# EAGLE schematic Piezo_signal_amp_filter_v0.1 (EAGLE 9.5.2)
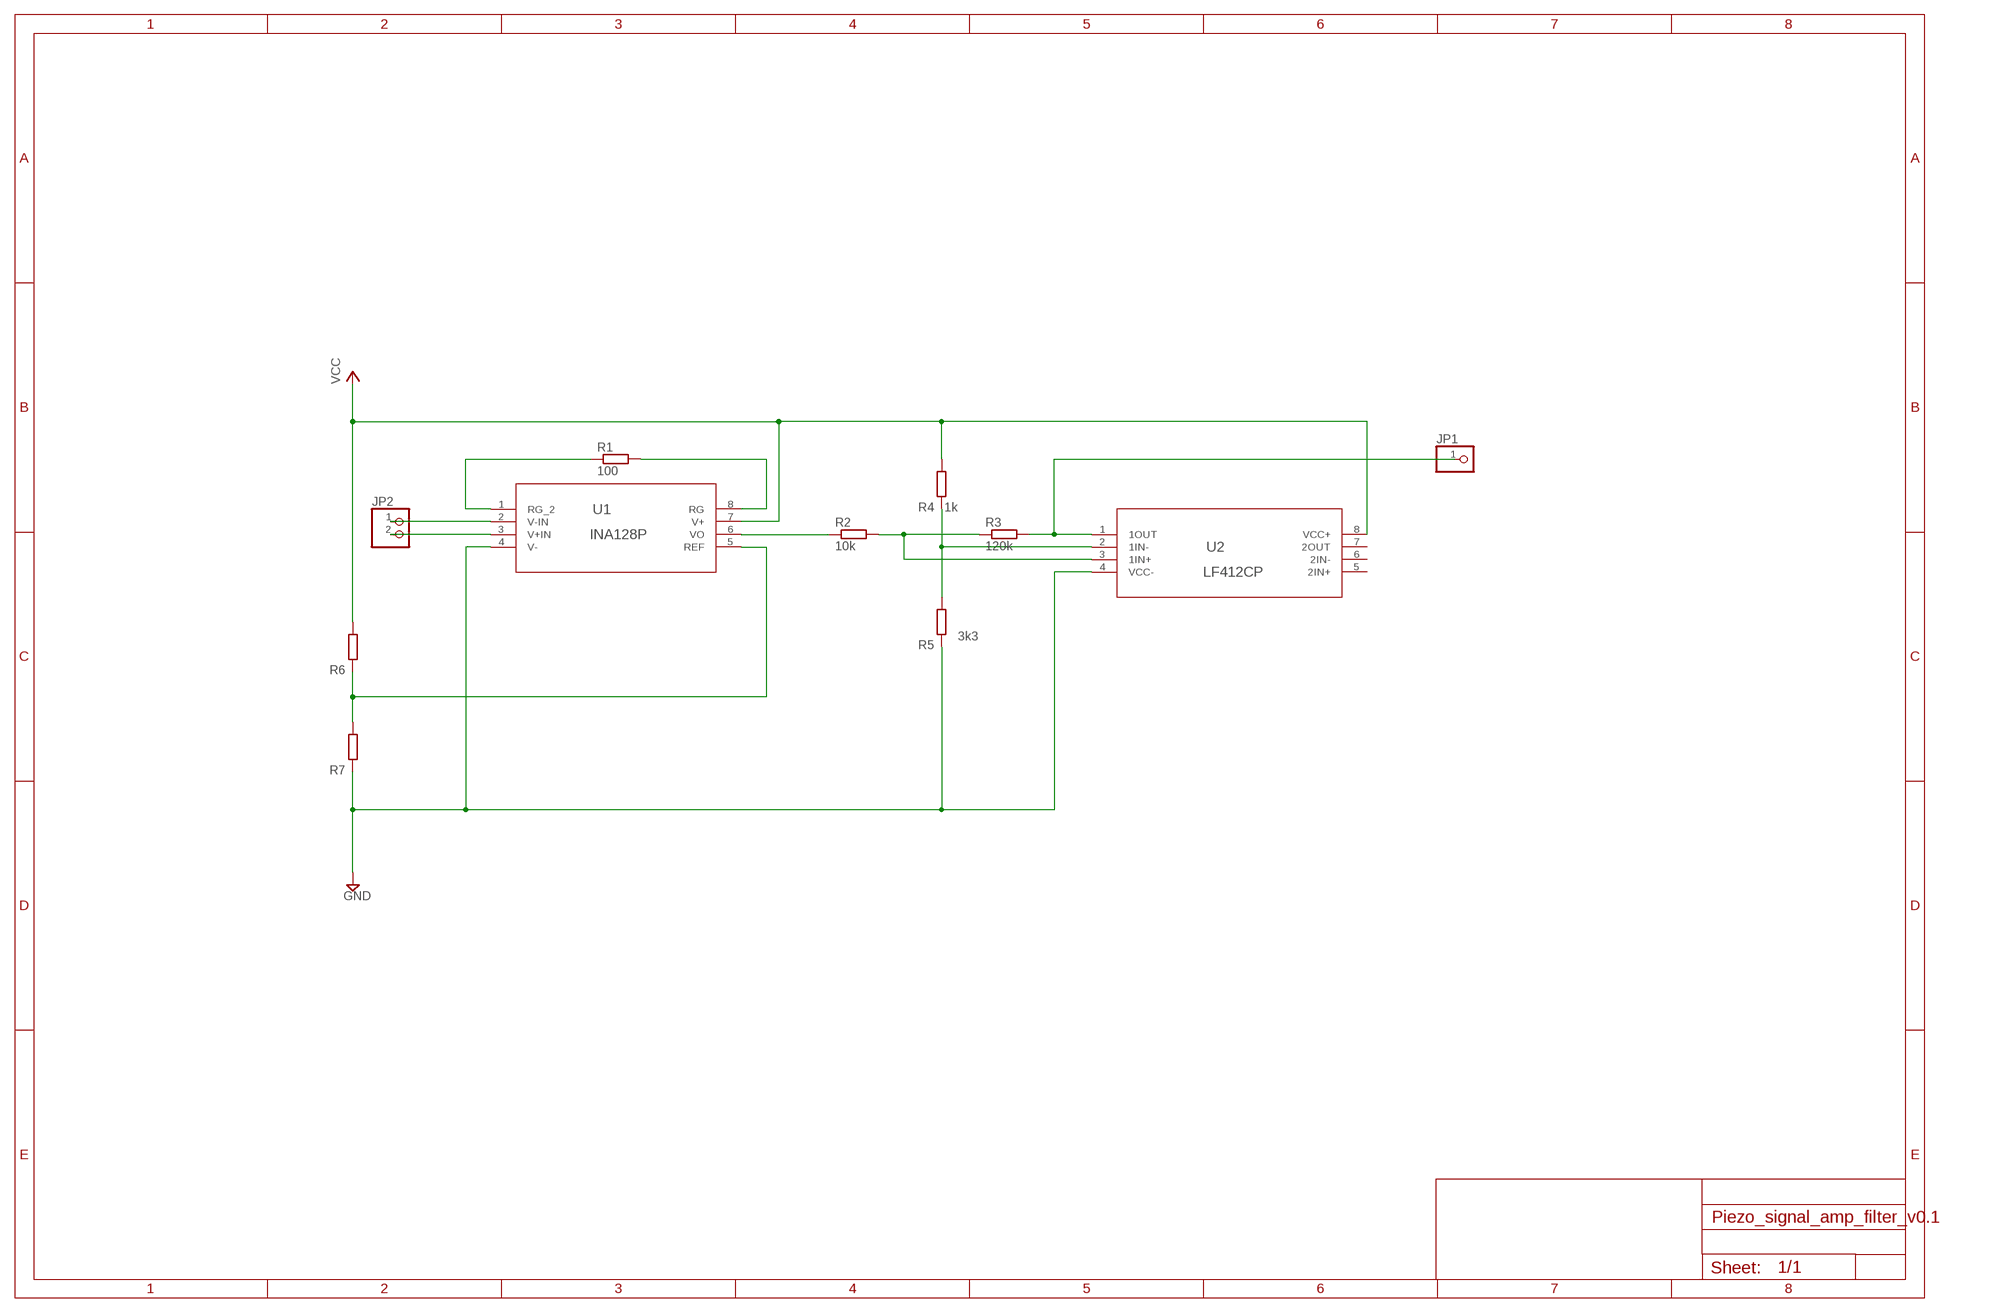
[diagram p0: schematic, sheet 1]

## Parts
JP1  PINHD-1X1  [1X01]
JP2  PINHD-1X2  [1X02]
R1  100  R-EU_0207/10  [0207/10]
R2  10k  R-EU_0207/10  [0207/10]
R3  120k  R-EU_0207/10  [0207/10]
R4  1k  R-EU_0207/10  [0207/10]
R5  3k3  R-EU_0207/10  [0207/10]
R6  R-EU_0207/10  [0207/10]
R7  R-EU_0207/10  [0207/10]
U1  INA128P  [P8]
U2  LF412CP  [P8]

## Nets
GND: R5.1 R7.1 U1.4(V-) U2.4(VCC-)
N$1: R6.1 R7.2 U1.5(REF)
N$2: R1.1 U1.1(RG_2)
N$3: R1.2 U1.8(RG)
N$4: R4.1 R5.2 U2.2(1IN-)
N$5: JP1.1 R3.2 U2.1(1OUT)
N$6: R2.1 U1.6(VO)
N$7: R2.2 R3.1 U2.3(1IN+)
N$9: JP2.2 U1.3(V+IN)
N$10: JP2.1 U1.2(V-IN)
VCC: R4.2 R6.2 U1.7(V+) U2.8(VCC+)
Unconnected: U2.5(2IN+) U2.6(2IN-) U2.7(2OUT)

## Library data of the parts
JP1 = Connector:PINHD-1X1: PIN HEADER; CATEGORY: CONNECTOR; SUB-CATEGORY: PIN-HEADER
JP2 = Connector:PINHD-1X2: PIN HEADER; CATEGORY: CONNECTOR; SUB-CATEGORY: PIN-HEADER
R1-R7 = rcl:R-EU_: RESISTOR, European symbol; SPICEPREFIX: R
U1 = oma_belgia_projektiin:INA128P; DATASHEET_URL: http://www.ti.com/lit/gpn/INA128; DESCRIPTION: Precision, Low Power Instrumentation Amplifiers; FAMILY_NAME: DUAL SUPPLY; GENERIC_PART_NUMBER: INA128; INDUSTRY_STD_PKG_TYPE: PDIP; MANUFACTURER: Texas Instruments; MANUFACTURER_PART_NUMBER: INA128P; PACKAGE_DESIGNATOR: P; PIN_COUNT: 8; VENDOR: Texas Instruments
U2 = oma_belgia_projektiin:LF412CP; DATASHEET_URL: http://www.ti.com/lit/gpn/LF412; DESCRIPTION: Dual JFET-input Operational Amplifier; FAMILY_NAME: STANDARD LINEAR AMPLIFIER; GENERIC_PART_NUMBER: LF412; INDUSTRY_STD_PKG_TYPE: PDIP; MANUFACTURER: Texas Instruments; MANUFACTURER_PART_NUMBER: LF412CP; PACKAGE_DESIGNATOR: P; PIN_COUNT: 8; VENDOR: Texas Instruments